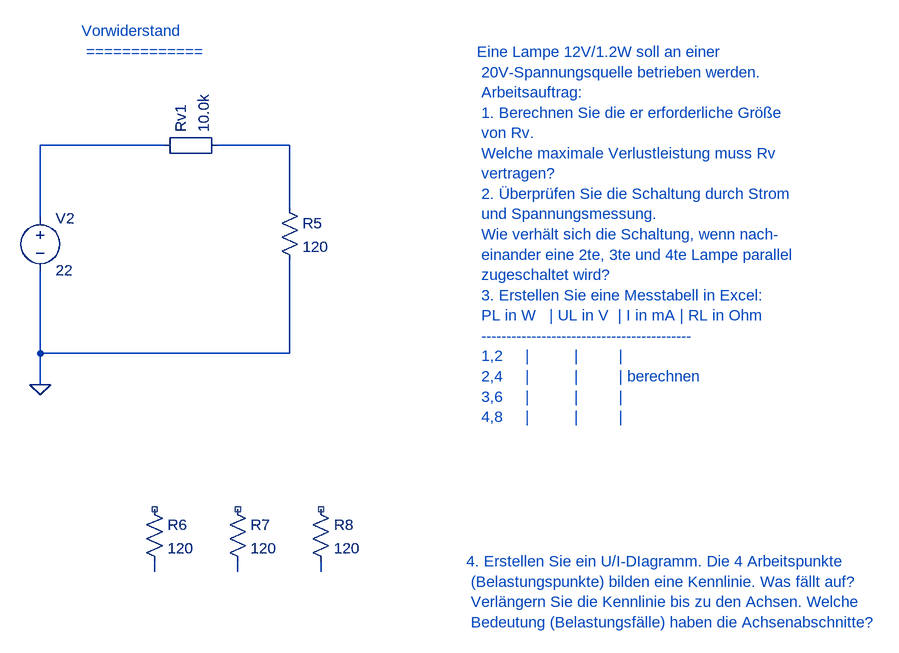
[diagram p0: schematic 1_1_5_Vorwiderstand.asc]
1_1_5_Vorwiderstand.asc, the LTspice schematic file:
Version 4
SHEET 1 880 680
WIRE 96 432 96 448
WIRE 480 416 480 432
WIRE 272 880 272 896
WIRE 400 880 400 896
WIRE 528 880 528 896
WIRE 96 448 96 560
WIRE 288 240 96 240
WIRE 96 240 96 352
WIRE 480 336 480 240
WIRE 480 240 368 240
WIRE 96 560 96 608
WIRE 480 432 480 560
WIRE 480 560 96 560
FLAG 96 608 0
SYMBOL voltage 96 336 R0
SYMATTR InstName V2
SYMATTR Value 22
SYMBOL Misc\EuropeanResistor 272 256 R270
SYMATTR InstName Rv1
SYMATTR Value 10.0k
SYMBOL res 464 320 R0
SYMATTR InstName R5
SYMATTR Value 120
SYMBOL res 256 784 R0
SYMATTR InstName R6
SYMATTR Value 120
SYMBOL res 384 784 R0
SYMATTR InstName R7
SYMATTR Value 120
SYMBOL res 512 784 R0
SYMATTR InstName R8
SYMATTR Value 120
TEXT 160 64 Left 2 ;Vorwiderstand \n =============
TEXT 768 96 Left 2 ;Eine Lampe 12V/1.2W soll an einer \n 20V-Spannungsquelle betrieben werden. \n Arbeitsauftrag: \n 1. Berechnen Sie die er erforderliche Größe \n von Rv. \n Welche maximale Verlustleistung muss Rv \n vertragen? \n 2. Überprüfen Sie die Schaltung durch Strom \n und Spannungsmessung. \n Wie verhält sich die Schaltung, wenn nach- \n einander eine 2te, 3te und 4te Lampe parallel \n zugeschaltet wird? \n 3. Erstellen Sie eine Messtabell in Excel: \n PL in W   | UL in V  | I in mA | RL in Ohm \n ------------------------------------------ \n 1,2     |          |         | \n 2,4     |          |         | berechnen \n 3,6     |          |         | \n 4,8     |          |         |
TEXT 752 880 Left 2 ;4. Erstellen Sie ein U/I-DIagramm. Die 4 Arbeitspunkte \n (Belastungspunkte) bilden eine Kennlinie. Was fällt auf? \n Verlängern Sie die Kennlinie bis zu den Achsen. Welche \n Bedeutung (Belastungsfälle) haben die Achsenabschnitte?

The netlist it stands for:
* 1_1_5_Vorwiderstand.asc
V2 N004 0 22
Rv1 N004 N005 10.0k
R5 N005 0 120
R6 NC_01 N001 120
R7 NC_02 N002 120
R8 NC_03 N003 120
* Vorwiderstand
*  =============
* Eine Lampe 12V/1.2W soll an einer
*  20V-Spannungsquelle betrieben werden.
*  Arbeitsauftrag:
*  1. Berechnen Sie die er erforderliche Größe
*  von Rv.
*  Welche maximale Verlustleistung muss Rv
*  vertragen?
*  2. Überprüfen Sie die Schaltung durch Strom
*  und Spannungsmessung.
*  Wie verhält sich die Schaltung, wenn nach-
*  einander eine 2te, 3te und 4te Lampe parallel
*  zugeschaltet wird?
*  3. Erstellen Sie eine Messtabell in Excel:
*  PL in W   | UL in V  | I in mA | RL in Ohm
*  ------------------------------------------
*  1,2     |          |         |
*  2,4     |          |         | berechnen
*  3,6     |          |         |
*  4,8     |          |         |
* 4. Erstellen Sie ein U/I-DIagramm. Die 4 Arbeitspunkte
*  (Belastungspunkte) bilden eine Kennlinie. Was fällt auf?
*  Verlängern Sie die Kennlinie bis zu den Achsen. Welche
*  Bedeutung (Belastungsfälle) haben die Achsenabschnitte?
.backanno
.end